# EasyEDA schematic SCH_GesPot_2025-03-14.json
TITLE: Sheet_1; REV: 1.0; Date: 2025-03-13; Sheet: 1/1; Drawn By: williamgwok; Company: Your Company
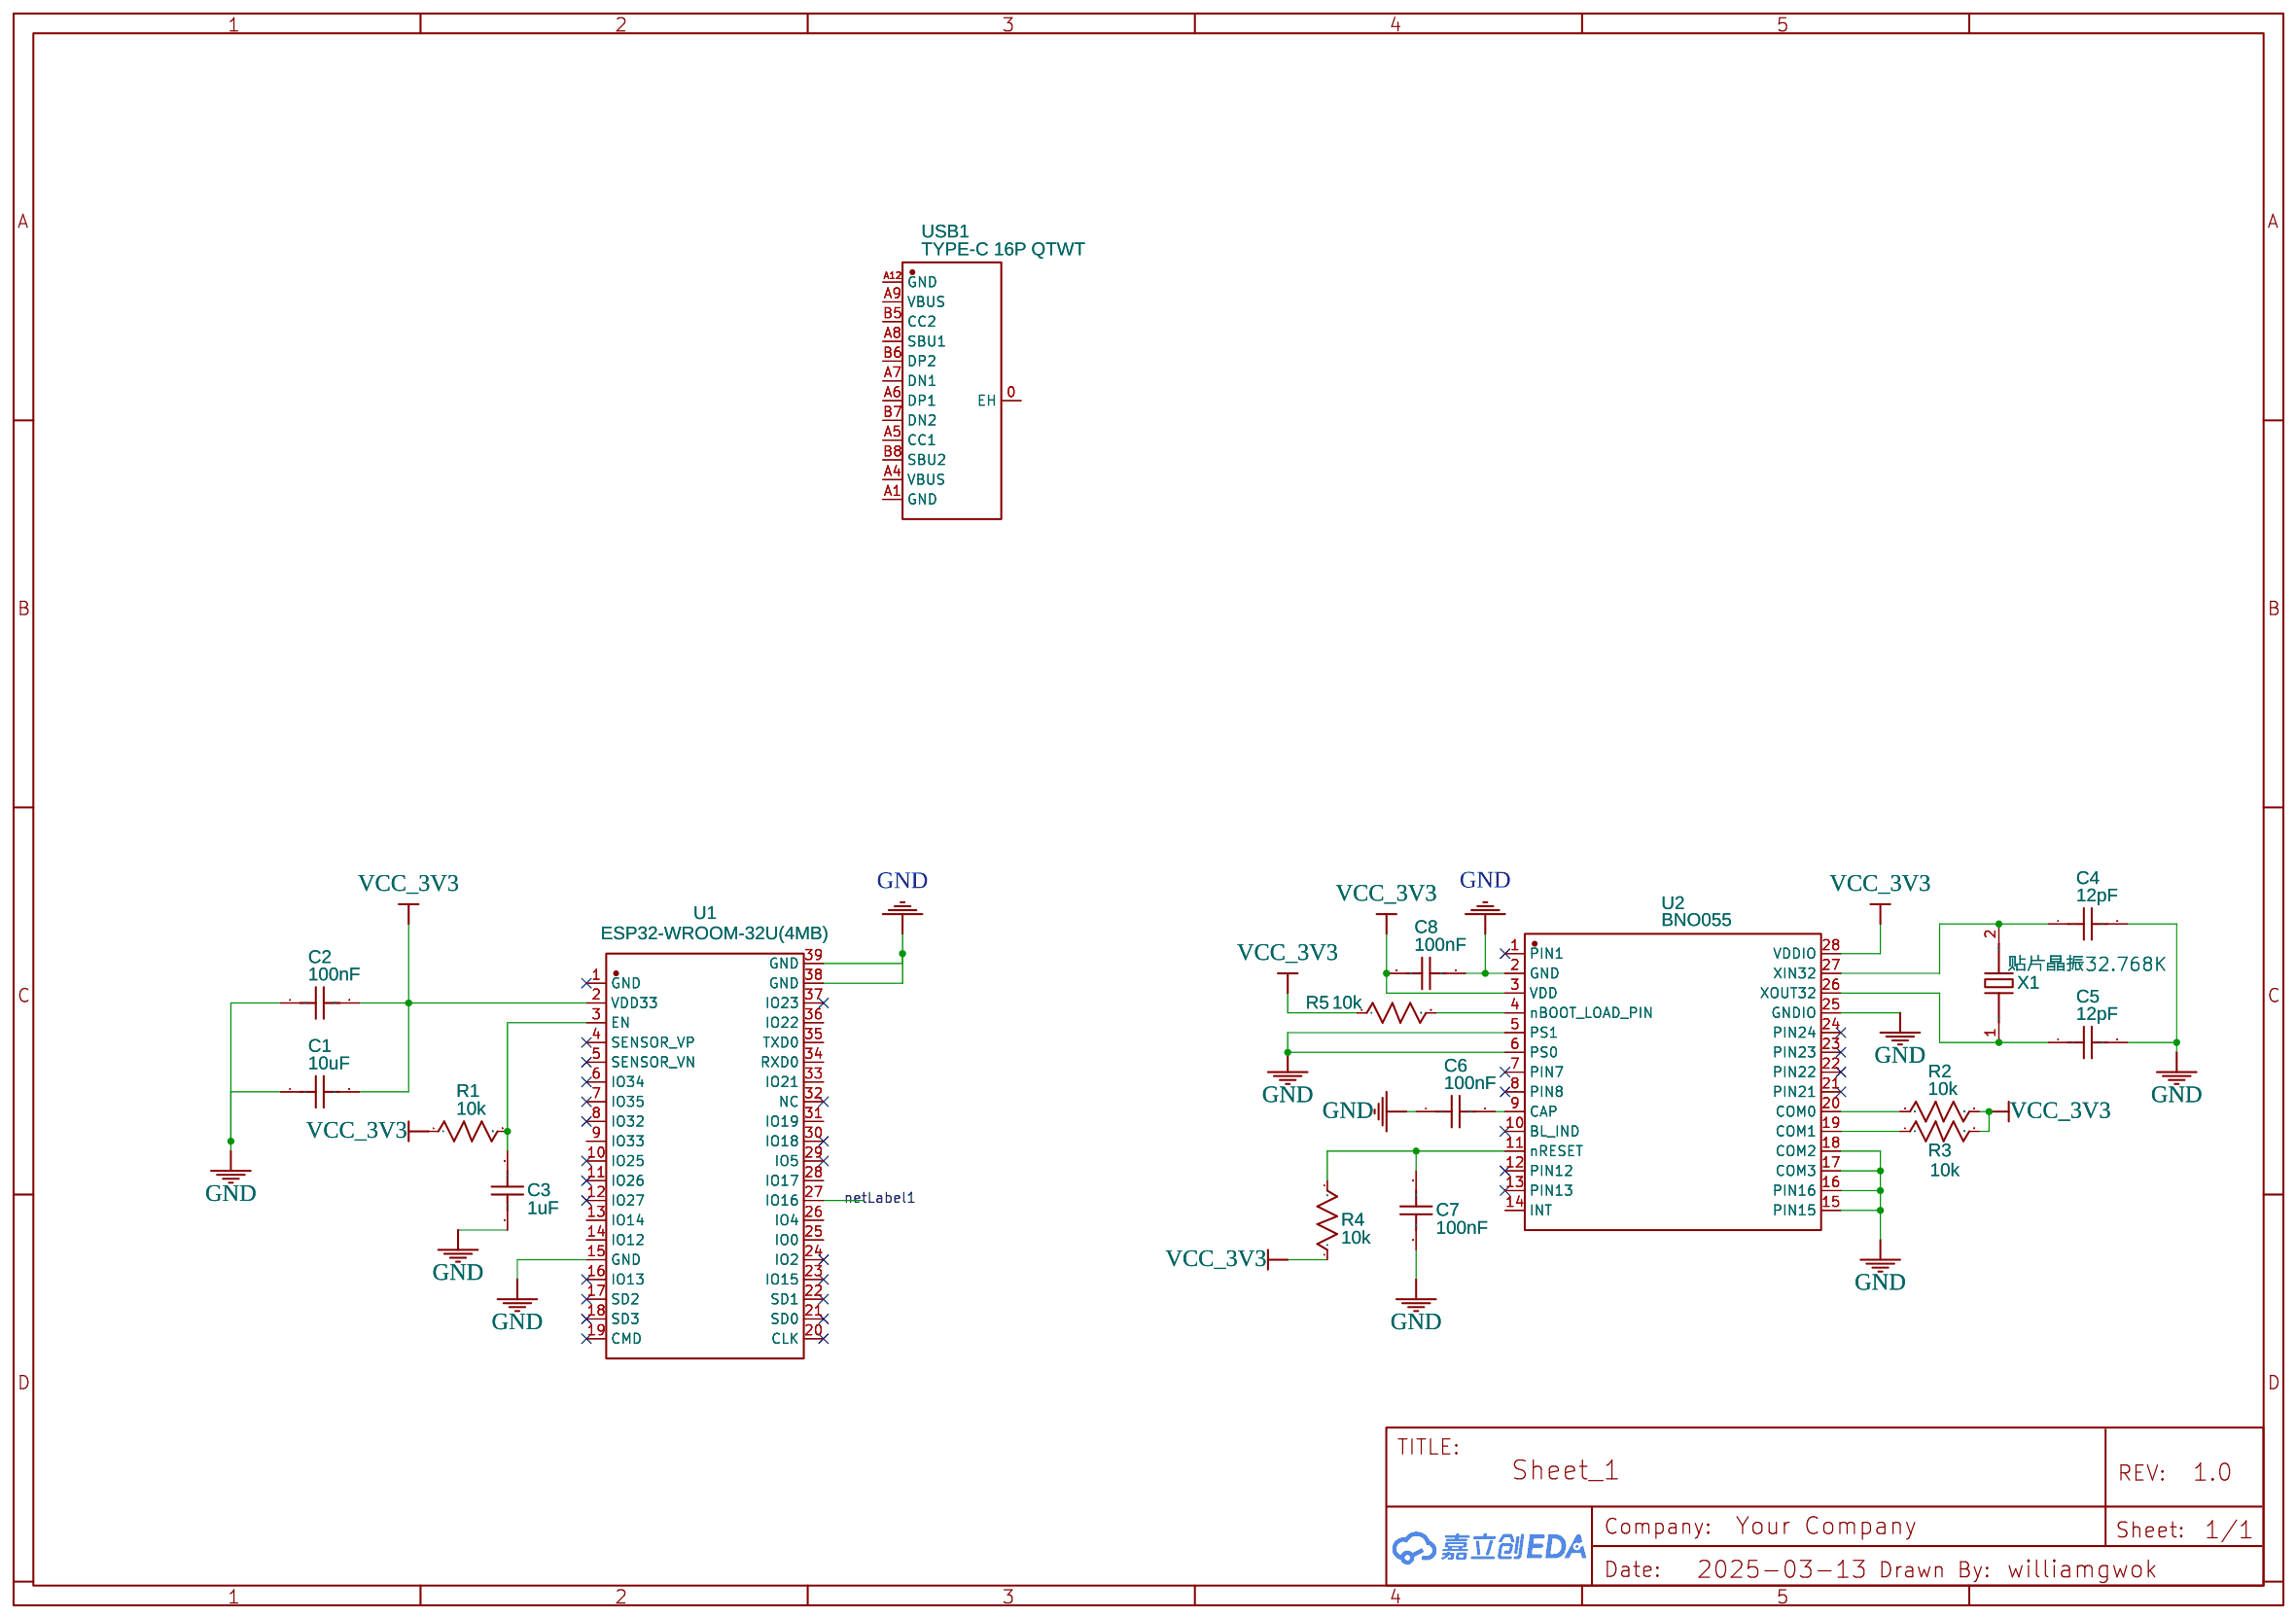
[diagram p0: schematic sheet]

## Parts
C1  10uF  [C0603]
C2  100nF  [C0603]
C3  1uF  [C0603]
C4  12pF  [C0603]
C5  12pF  [C0603]
C6  100nF  [C0603]
C7  100nF  [C0603]
C8  100nF  [C0603]
R1  10k  [R0603]
R2  10k  [R0603]
R3  10k  [R0603]
R4  10k  [R0603]
R5  10k  [R0603]
U1  ESP32-WROOM-32U(4MB)  [WIFI-SMD_ESP32-WROOM-32UE-A]
U2  BNO055  [LGA-28_L5.2-W3.8-P0.50-BL]
USB1  TYPE-C 16P QTWT  [USB-TYPE-C-SMD_TYPE-C-16P-QTWT]
X1  贴片晶振32.768K  [OSC-SMD_2P-L3.2-W1.5-1]

## Library data of the parts
C1-C8 = C_0603_US: Contributor: LCEDA_Lib
R1-R5 = R_0603_US: Contributor: LCEDA_Lib
U1 = ESP32-WROOM-32U(4MB): Contributor: LCSC; Supplier: LCSC; Supplier Part: C2934572; Manufacturer: ESPRESSIF(乐鑫); JLCPCB Part Class: Extended Part
U2 = BNO055: Contributor: LCSC; Supplier: LCSC; Supplier Part: C93216; Manufacturer: Bosch(博世); JLCPCB Part Class: Extended Part
USB1 = TYPE-C 16P QTWT: Contributor: lcsc; Supplier: LCSC; Supplier Part: C5187472; Manufacturer: SHOU HAN(首韩); JLCPCB Part Class: Extended Part
X1 = 贴片晶振32.768K: Contributor: LCSC; Supplier: LCSC; Supplier Part: C9900003950; Manufacturer Part: 贴片晶振32.768k; Manufacturer: null

## Nets
GND: C1.1 C2.1 C3.1 C4.2 C5.2 C6.1 C7.1 C8.1 U1.15(GND) U1.38(GND) U1.39(GND) U2.2(GND) U2.5(PS1) U2.6(PS0) U2.15(PIN15) U2.16(PIN16) U2.17(COM3) U2.18(COM2) U2.25(GNDIO)
VCC_3V3: C1.2 C2.2 C8.2 R1.1 R2.2 R3.2 R4.1 R5.1 U1.2(VDD33) U2.3(VDD) U2.28(VDDIO)
netLabel1: U1.27(IO16)
Net-(C3-2): C3.2 R1.2 U1.3(EN)
Net-(C4-1): C4.1 U2.27(XIN32) X1.2
Net-(C5-1): C5.1 U2.26(XOUT32) X1.1
Net-(C6-2): C6.2 U2.9(CAP)
Net-(C7-2): C7.2 R4.2 U2.11(nRESET)
Net-(R2-1): R2.1 U2.20(COM0)
Net-(R3-1): R3.1 U2.19(COM1)
Net-(R5-2): R5.2 U2.4(nBOOT_LOAD_PIN)

Not connected (* = marked no-connect by the designer): U1 1(GND)* 4(SENSOR_VP)* 5(SENSOR_VN)* 6(IO34)* 7(IO35)* 8(IO32)* 9(IO33) 10(IO25)* 11(IO26)* 12(IO27)* 13(IO14) 14(IO12) 16(IO13)* 17(SD2)* 18(SD3)* 19(CMD)* 20(CLK)* 21(SD0)* 22(SD1)* 23(IO15)* 24(IO2)* 25(IO0) 26(IO4) 28(IO17) 29(IO5)* 30(IO18)* 31(IO19) 32(NC)* 33(IO21) 34(RXD0) 35(TXD0) 36(IO22) 37(IO23)*; U2 1(PIN1)* 7(PIN7)* 8(PIN8)* 10(BL_IND)* 12(PIN12)* 13(PIN13)* 14(INT) 21(PIN21)* 22(PIN22)* 23(PIN23)* 24(PIN24)*; USB1 0(EH) A1(GND) A4(VBUS) A5(CC1) A6(DP1) A7(DN1) A8(SBU1) A9(VBUS) A12(GND) B5(CC2) B6(DP2) B7(DN2) B8(SBU2)
